# Altium schematic sheet ADC.SchDoc
size A4; SheetNumber: 4; SheetTotal: 5
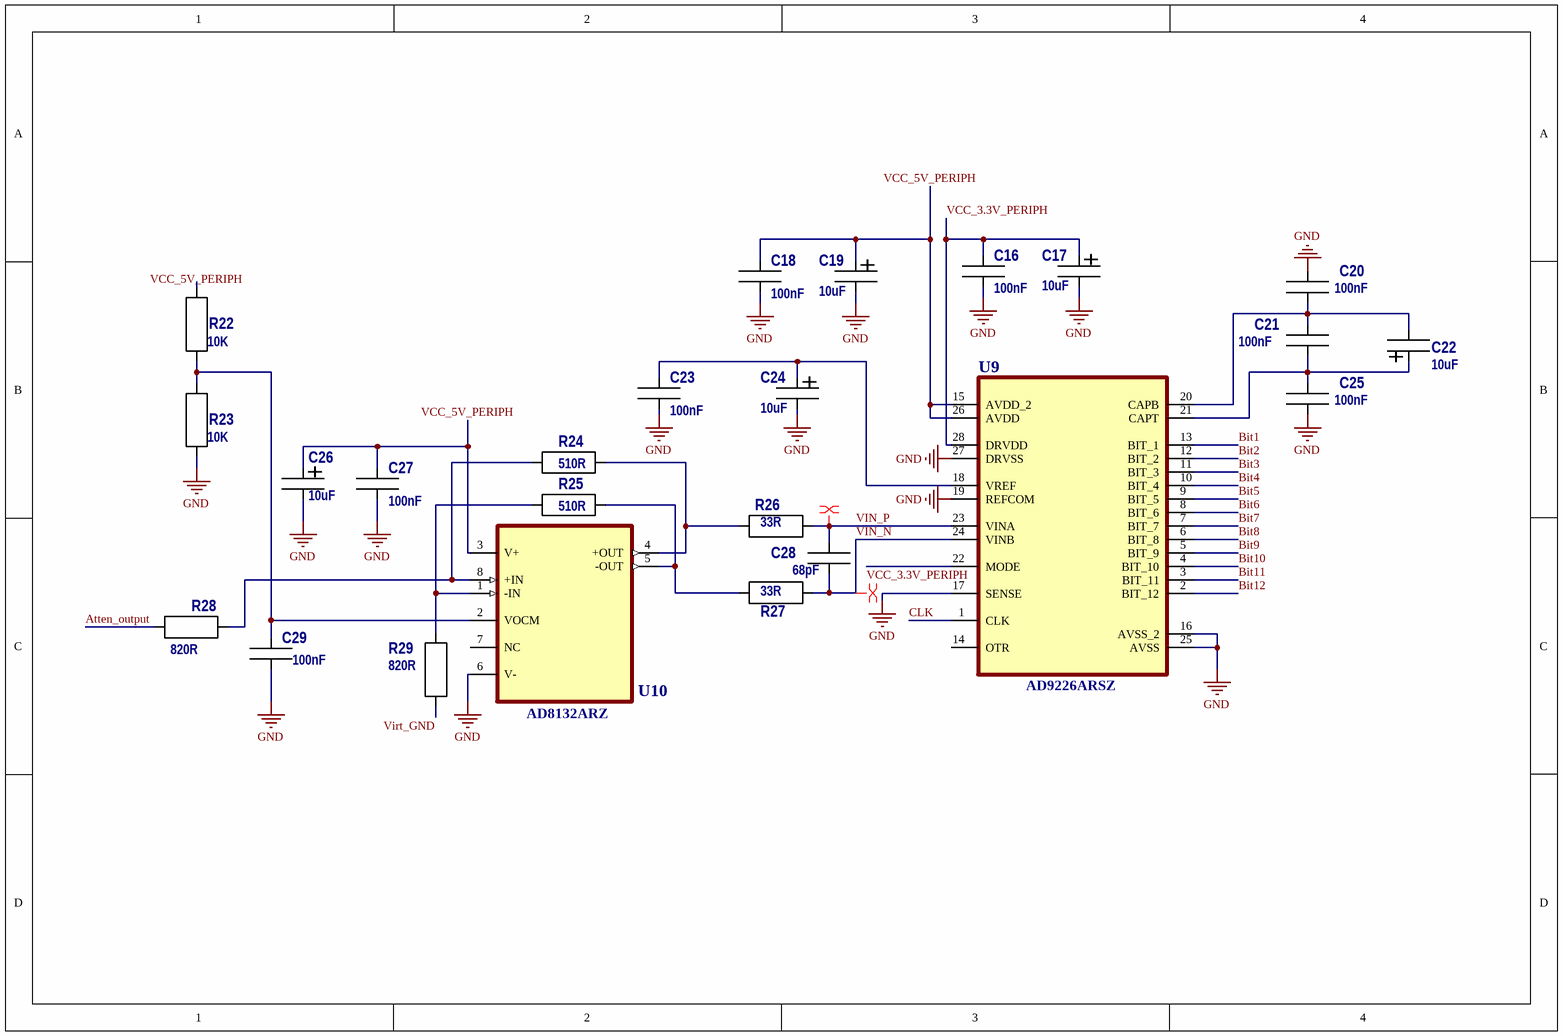
[diagram p0: ADC.SchDoc]

## Parts
C16  100nF  [CAP 0603 3D]
C17  10uF  [Tant B]
C18  100nF  [CAP 0603 3D]
C19  10uF  [Tant B]
C20  100nF  [CAP 0603 3D]
C21  100nF  [CAP 0603 3D]
C22  10uF  [Tant B]
C23  100nF  [CAP 0603 3D]
C24  10uF  [Tant B]
C25  100nF  [CAP 0603 3D]
C26  10uF  [Tant B]
C27  100nF  [cap 1206 3D]
C28  68pF  [CAP 0603 3D]
C29  100nF  [CAP 0603 3D]
R22  10K  [Res_0603 3D]
R23  10K  [Res_0603 3D]
R24  510R  [Res_0603 3D]
R25  510R  [Res_0603 3D]
R26  33R  [Res_0603 3D]
R27  33R  [Res_0603 3D]
R28  820R  [Res_0603 3D]
R29  820R  [Res_0603 3D]
U9  AD9226ARSZ  [SOP65P780X200-28N]
U10  AD8132ARZ  [SOIC127P600X175-8N]

## Nets
GND: C16.2 C17.2(-) C18.2 C19.2(-) C20.1 C23.2 C24.2(-) C25.2 C26.2(-) C27.2 C29.2 R23.1 U9.16(AVSS_2) U9.17(SENSE) U9.19(REFCOM) U9.25(AVSS) U9.27(DRVSS) U10.6(V-)
Atten_output: R28.2
Bit1: U9.13(BIT_1)
Bit2: U9.12(BIT_2)
Bit3: U9.11(BIT_3)
Bit4: U9.10(BIT_4)
Bit5: U9.9(BIT_5)
Bit6: U9.8(BIT_6)
Bit7: U9.7(BIT_7)
Bit8: U9.6(BIT_8)
Bit9: U9.5(BIT_9)
Bit10: U9.4(BIT_10)
Bit11: U9.3(BIT_11)
Bit12: U9.2(BIT_12)
CLK: U9.1(CLK)
VCC_3.3V_PERIPH: C16.1 C17.1(+) U9.22(MODE) U9.28(DRVDD)
VCC_5V_PERIPH: C18.1 C19.1(+) C26.1(+) C27.1 R22.2 U9.15(AVDD_2) U9.26(AVDD) U10.3(V+)
VIN_N: C28.2 R27.1 U9.24(VINB)
VIN_P: C28.1 R26.1 U9.23(VINA)
Virt_GND: R29.2
NetC20_2: C20.2 C21.1 C22.2(-) U9.20(CAPB)
NetC21_2: C21.2 C22.1(+) C25.1 U9.21(CAPT)
NetC23_1: C23.1 C24.1(+) U9.18(VREF)
NetC29_1: C29.1 R22.1 R23.2 U10.2(VOCM)
NetR24_1: R24.1 R26.2 U10.4(+OUT)
NetR24_2: R24.2 R28.1 U10.8(+IN)
NetR25_1: R25.1 R27.2 U10.5(-OUT)
NetR25_2: R25.2 R29.1 U10.1(-IN)

Not connected (* = marked no-connect by the designer): U9 14(OTR); U10 7(NC)

## Layout directives
differential pair: VIN_N, VIN_P

## Library data of the parts
C16 C18 C20 C21 C23 C25 C27 C29 = C: 0603 100nF X7R
C17 C19 C22 C24 C26 = C T: SMD type B 10 uF min 16V
C28 = C: 0805 68pF NP0 (C0G)
R22 R23 = R: 10K 0805
R24-R29 = R: 0805 0.1%
U9 = AD9226ARSZ: 12-Bit, 65 MSPS Analog-to-Digital Converter; MF: Analog Devices; SnapEDA_Link: https://www.snapeda.com/parts/AD9226ARSZ/Analog+Devices/view-part/?ref=snap; Package: SSOP-28 Analog Devices; Value: *; MP: AD9226ARSZ; Check_prices: https://www.snapeda.com/parts/AD9226ARSZ/Analog+Devices/view-part/?ref=eda
U10 = AD8132ARZ: Low Cost, High Speed Differential Amplifier; MF: Analog Devices; SnapEDA_Link: https://www.snapeda.com/parts/AD8132ARZ/Analog+Devices/view-part/?ref=snap; Package: SOIC-8 Analog Devices; Value: *; MP: AD8132ARZ; Check_prices: https://www.snapeda.com/parts/AD8132ARZ/Analog+Devices/view-part/?ref=eda